# Altium project divisor.PrjPCB
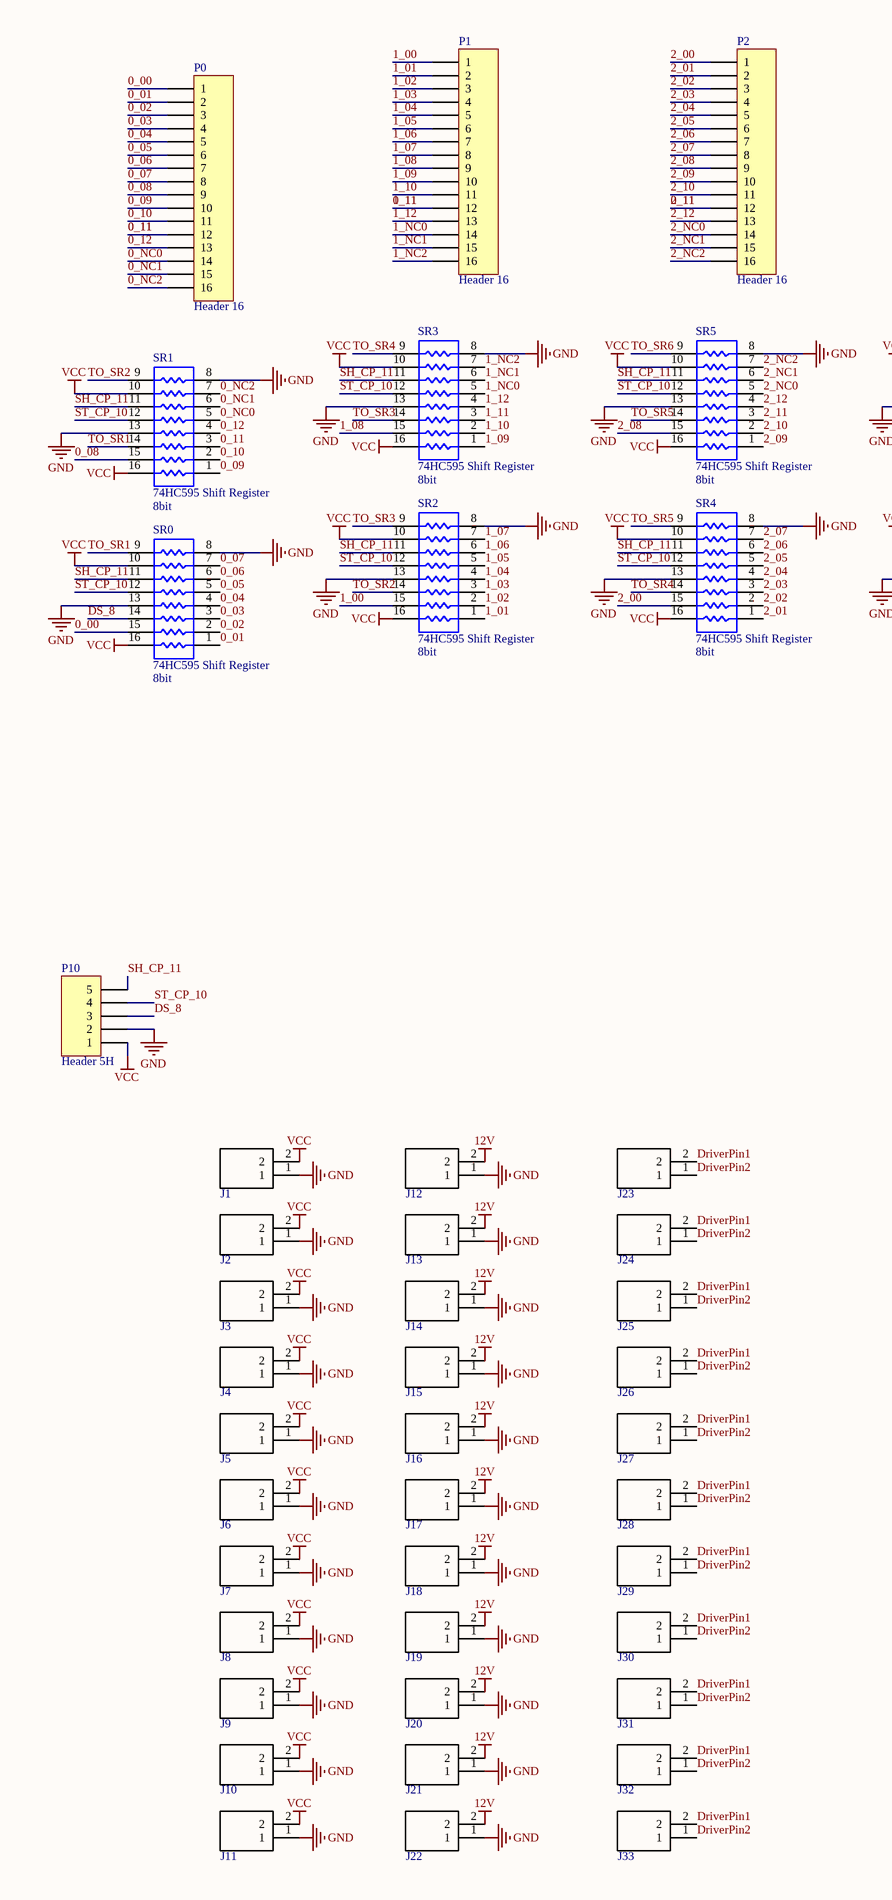
[diagram p0: divisor.SchDoc, left]
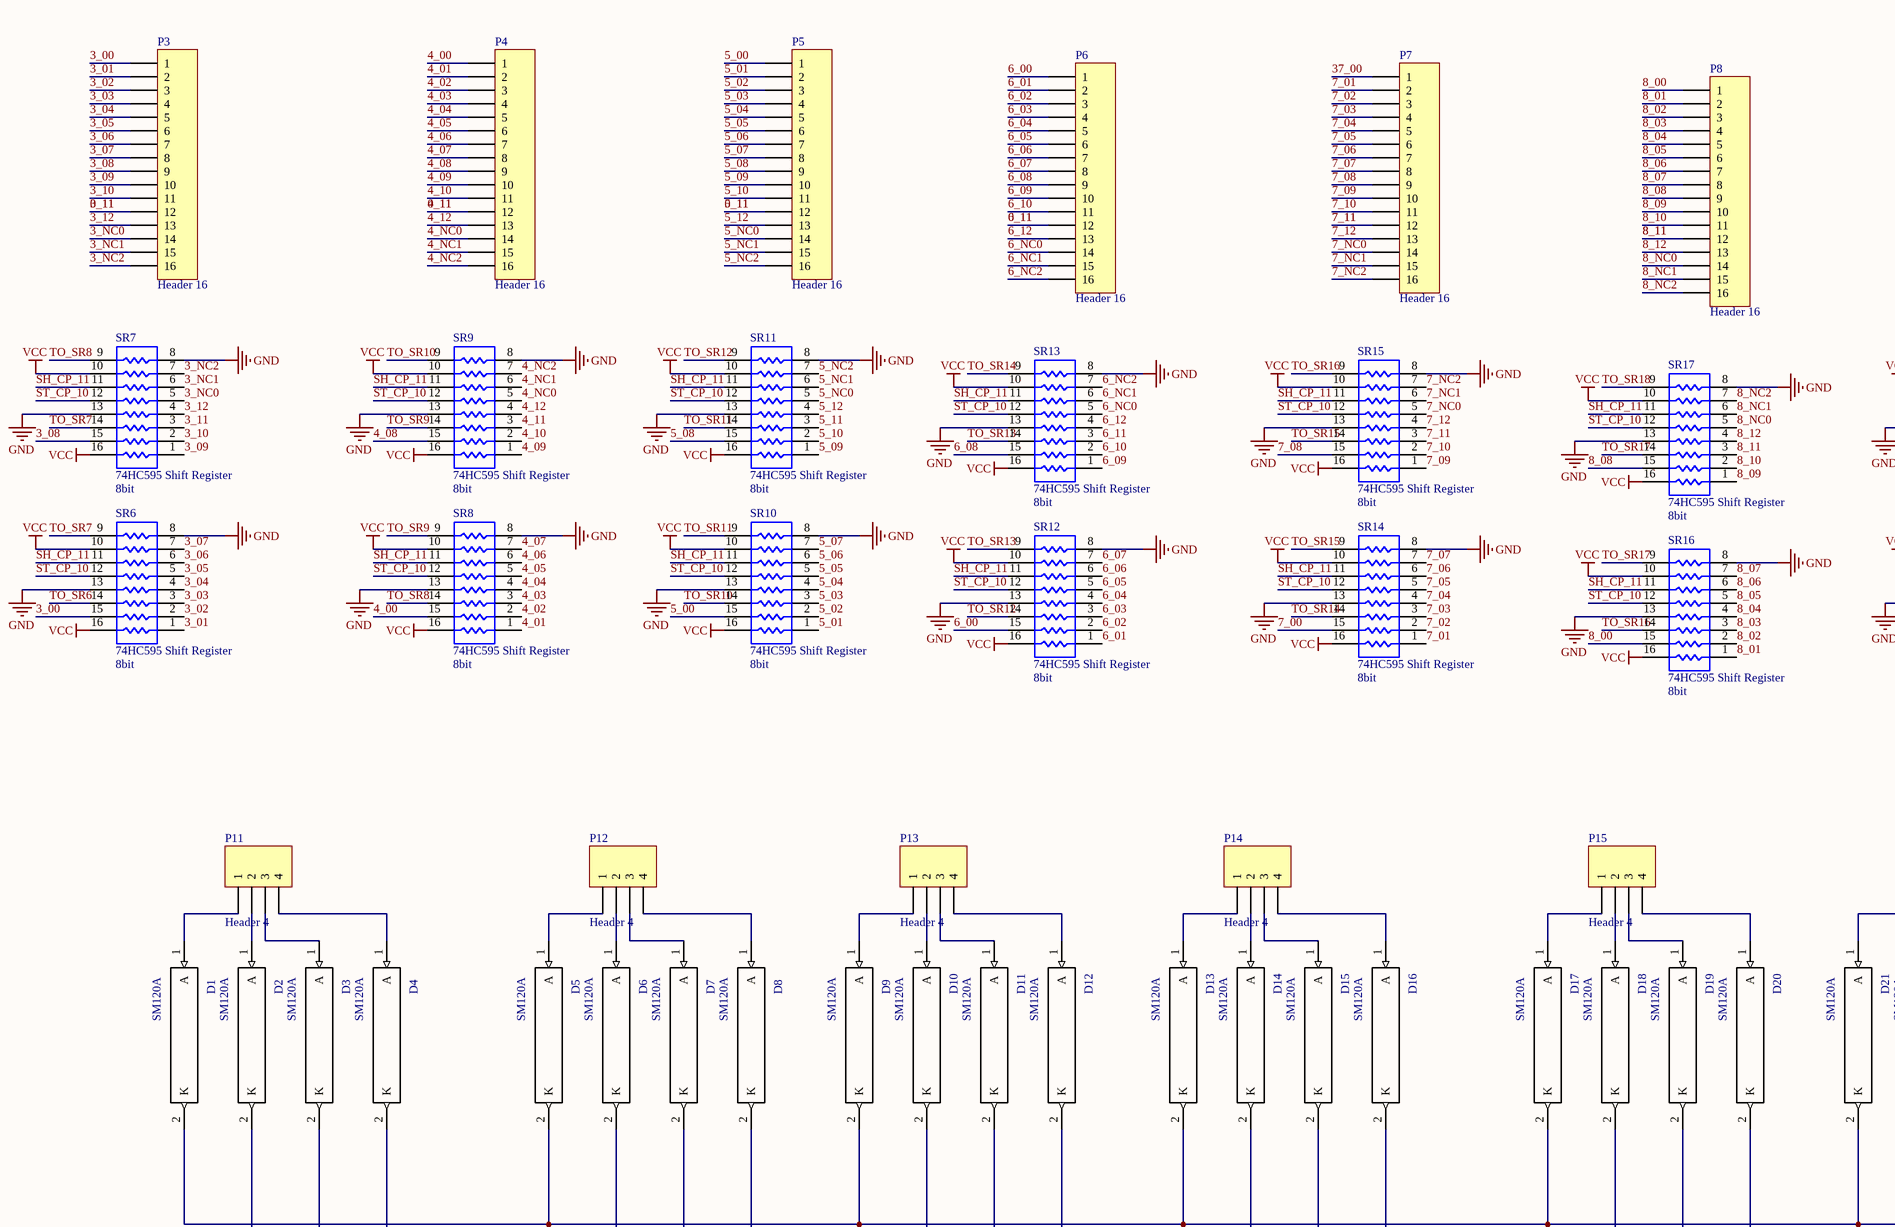
[diagram p1: divisor.SchDoc, middle]
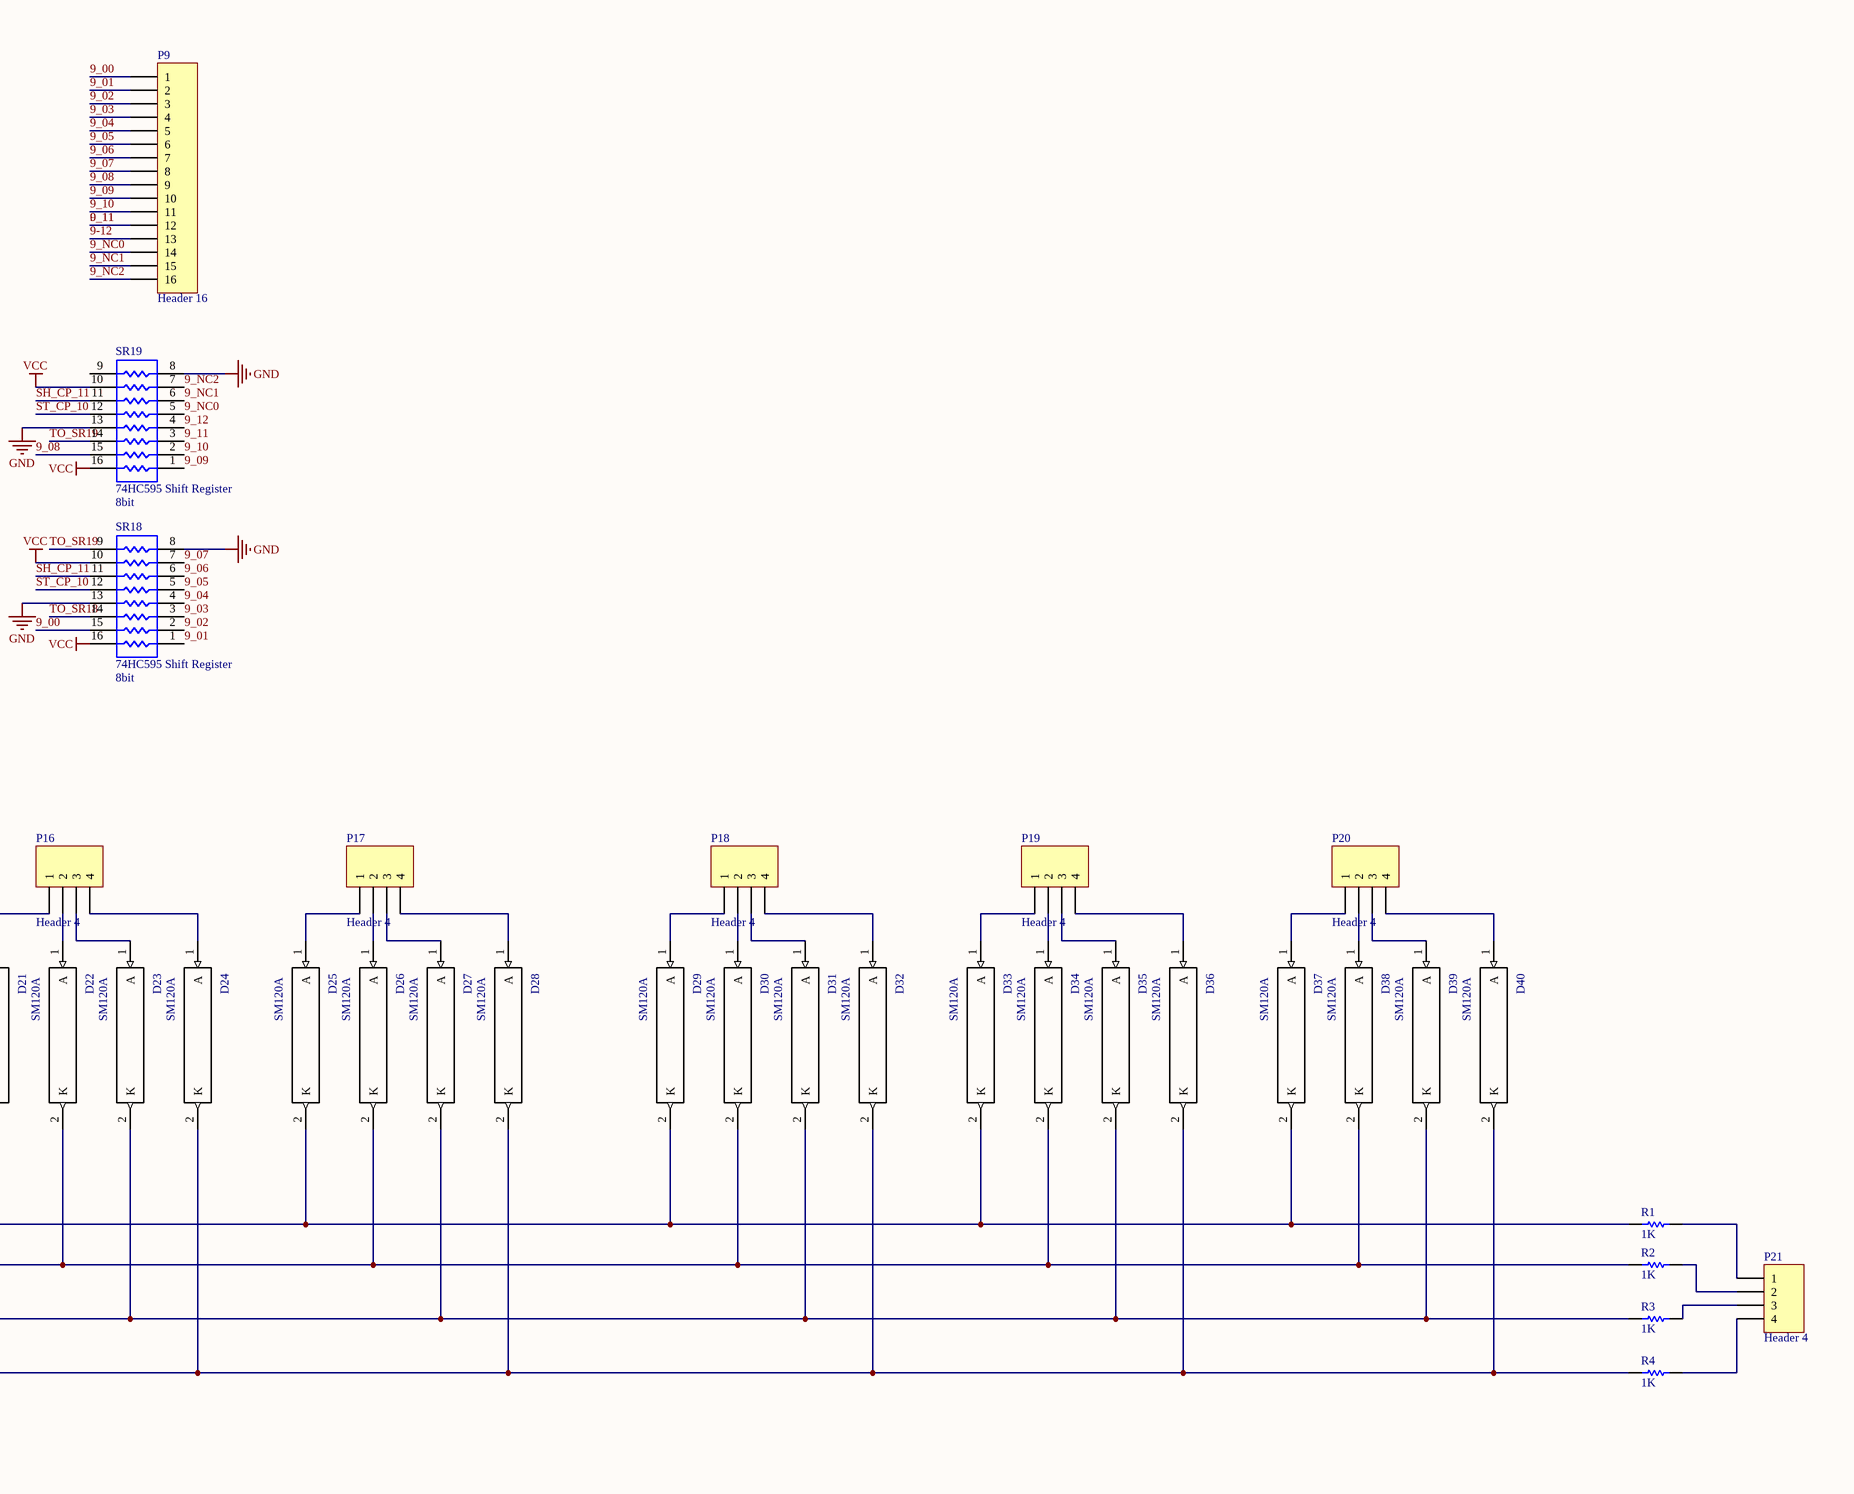
[diagram p2: divisor.SchDoc, right]
1 sheet, 119 parts. Net scope: global (net labels, ports and power ports of the same name join across sheets).
Board files: divisor.PcbDoc, divisor-new.PcbDoc

## Sheet divisor.SchDoc
size A0

### Parts
D1  SM120A  [*DIOM5227X270N_S1M(Primary)]
D2  SM120A  [*DIOM5227X270N_S1M(Primary)]
D3  SM120A  [*DIOM5227X270N_S1M(Primary)]
D4  SM120A  [*DIOM5227X270N_S1M(Primary)]
D5  SM120A  [*DIOM5227X270N_S1M(Primary)]
D6  SM120A  [*DIOM5227X270N_S1M(Primary)]
D7  SM120A  [*DIOM5227X270N_S1M(Primary)]
D8  SM120A  [*DIOM5227X270N_S1M(Primary)]
D9  SM120A  [*DIOM5227X270N_S1M(Primary)]
D10  SM120A  [*DIOM5227X270N_S1M(Primary)]
D11  SM120A  [*DIOM5227X270N_S1M(Primary)]
D12  SM120A  [*DIOM5227X270N_S1M(Primary)]
D13  SM120A  [*DIOM5227X270N_S1M(Primary)]
D14  SM120A  [*DIOM5227X270N_S1M(Primary)]
D15  SM120A  [*DIOM5227X270N_S1M(Primary)]
D16  SM120A  [*DIOM5227X270N_S1M(Primary)]
D17  SM120A  [*DIOM5227X270N_S1M(Primary)]
D18  SM120A  [*DIOM5227X270N_S1M(Primary)]
D19  SM120A  [*DIOM5227X270N_S1M(Primary)]
D20  SM120A  [*DIOM5227X270N_S1M(Primary)]
D21  SM120A  [*DIOM5227X270N_S1M(Primary)]
D22  SM120A  [*DIOM5227X270N_S1M(Primary)]
D23  SM120A  [*DIOM5227X270N_S1M(Primary)]
D24  SM120A  [*DIOM5227X270N_S1M(Primary)]
D25  SM120A  [*DIOM5227X270N_S1M(Primary)]
D26  SM120A  [*DIOM5227X270N_S1M(Primary)]
D27  SM120A  [*DIOM5227X270N_S1M(Primary)]
D28  SM120A  [*DIOM5227X270N_S1M(Primary)]
D29  SM120A  [*DIOM5227X270N_S1M(Primary)]
D30  SM120A  [*DIOM5227X270N_S1M(Primary)]
D31  SM120A  [*DIOM5227X270N_S1M(Primary)]
D32  SM120A  [*DIOM5227X270N_S1M(Primary)]
D33  SM120A  [*DIOM5227X270N_S1M(Primary)]
D34  SM120A  [*DIOM5227X270N_S1M(Primary)]
D35  SM120A  [*DIOM5227X270N_S1M(Primary)]
D36  SM120A  [*DIOM5227X270N_S1M(Primary)]
D37  SM120A  [*DIOM5227X270N_S1M(Primary)]
D38  SM120A  [*DIOM5227X270N_S1M(Primary)]
D39  SM120A  [*DIOM5227X270N_S1M(Primary)]
D40  SM120A  [*DIOM5227X270N_S1M(Primary)]
J1  6-1123723-2  [*TE_6-1123723-2]  (value not drawn)
J2  6-1123723-2  [*TE_6-1123723-2]  (value not drawn)
J3  6-1123723-2  [*TE_6-1123723-2]  (value not drawn)
J4  6-1123723-2  [*TE_6-1123723-2]  (value not drawn)
J5  6-1123723-2  [*TE_6-1123723-2]  (value not drawn)
J6  6-1123723-2  [*TE_6-1123723-2]  (value not drawn)
J7  6-1123723-2  [*TE_6-1123723-2]  (value not drawn)
J8  6-1123723-2  [*TE_6-1123723-2]  (value not drawn)
J9  6-1123723-2  [*TE_6-1123723-2]  (value not drawn)
J10  6-1123723-2  [*TE_6-1123723-2]  (value not drawn)
J11  6-1123723-2  [*TE_6-1123723-2]  (value not drawn)
J12  6-1123723-2  [*TE_6-1123723-2]  (value not drawn)
J13  6-1123723-2  [*TE_6-1123723-2]  (value not drawn)
J14  6-1123723-2  [*TE_6-1123723-2]  (value not drawn)
J15  6-1123723-2  [*TE_6-1123723-2]  (value not drawn)
J16  6-1123723-2  [*TE_6-1123723-2]  (value not drawn)
J17  6-1123723-2  [*TE_6-1123723-2]  (value not drawn)
J18  6-1123723-2  [*TE_6-1123723-2]  (value not drawn)
J19  6-1123723-2  [*TE_6-1123723-2]  (value not drawn)
J20  6-1123723-2  [*TE_6-1123723-2]  (value not drawn)
J21  6-1123723-2  [*TE_6-1123723-2]  (value not drawn)
J22  6-1123723-2  [*TE_6-1123723-2]  (value not drawn)
J23  6-1123723-2  [*TE_6-1123723-2]  (value not drawn)
J24  6-1123723-2  [*TE_6-1123723-2]  (value not drawn)
J25  6-1123723-2  [*TE_6-1123723-2]  (value not drawn)
J26  6-1123723-2  [*TE_6-1123723-2]  (value not drawn)
J27  6-1123723-2  [*TE_6-1123723-2]  (value not drawn)
J28  6-1123723-2  [*TE_6-1123723-2]  (value not drawn)
J29  6-1123723-2  [*TE_6-1123723-2]  (value not drawn)
J30  6-1123723-2  [*TE_6-1123723-2]  (value not drawn)
J31  6-1123723-2  [*TE_6-1123723-2]  (value not drawn)
J32  6-1123723-2  [*TE_6-1123723-2]  (value not drawn)
J33  6-1123723-2  [*TE_6-1123723-2]  (value not drawn)
P0  Header 16  [HDR1X16]
P1  Header 16  [HDR1X16]
P2  Header 16  [HDR1X16]
P3  Header 16  [HDR1X16]
P4  Header 16  [HDR1X16]
P5  Header 16  [HDR1X16]
P6  Header 16  [HDR1X16]
P7  Header 16  [HDR1X16]
P8  Header 16  [HDR1X16]
P9  Header 16  [HDR1X16]
P10  Header 5H  [hdr1x5]
P11  Header 4  [HDR1X4]
P12  Header 4  [HDR1X4]
P13  Header 4  [HDR1X4]
P14  Header 4  [HDR1X4]
P15  Header 4  [HDR1X4]
P16  Header 4  [HDR1X4]
P17  Header 4  [HDR1X4]
P18  Header 4  [HDR1X4]
P19  Header 4  [HDR1X4]
P20  Header 4  [HDR1X4]
P21  Header 4  [HDR1X4]
R1  value 1K  [6-0805_L]  (hidden comment: Res1)
R2  value 1K  [6-0805_L]  (hidden comment: Res1)
R3  value 1K  [6-0805_L]  (hidden comment: Res1)
R4  value 1K  [6-0805_L]  (hidden comment: Res1)
SR0  74HC595 Shift Register  value 8bit  [SO-16_L]
SR1  74HC595 Shift Register  value 8bit  [SO-16_L]
SR2  74HC595 Shift Register  value 8bit  [SO-16_L]
SR3  74HC595 Shift Register  value 8bit  [SO-16_L]
SR4  74HC595 Shift Register  value 8bit  [SO-16_L]
SR5  74HC595 Shift Register  value 8bit  [SO-16_L]
SR6  74HC595 Shift Register  value 8bit  [SO-16_L]
SR7  74HC595 Shift Register  value 8bit  [SO-16_L]
SR8  74HC595 Shift Register  value 8bit  [SO-16_L]
SR9  74HC595 Shift Register  value 8bit  [SO-16_L]
SR10  74HC595 Shift Register  value 8bit  [SO-16_L]
SR11  74HC595 Shift Register  value 8bit  [SO-16_L]
SR12  74HC595 Shift Register  value 8bit  [SO-16_L]
SR13  74HC595 Shift Register  value 8bit  [SO-16_L]
SR14  74HC595 Shift Register  value 8bit  [SO-16_L]
SR15  74HC595 Shift Register  value 8bit  [SO-16_L]
SR16  74HC595 Shift Register  value 8bit  [SO-16_L]
SR17  74HC595 Shift Register  value 8bit  [SO-16_L]
SR18  74HC595 Shift Register  value 8bit  [SO-16_L]
SR19  74HC595 Shift Register  value 8bit  [SO-16_L]

### Nets
12V: J12.2 J13.2 J14.2 J15.2 J16.2 J17.2 J18.2 J19.2 J20.2 J21.2 J22.2
GND: J1.1 J2.1 J3.1 J4.1 J5.1 J6.1 J7.1 J8.1 J9.1 J10.1 J11.1 J12.1 J13.1 J14.1 J15.1 J16.1 J17.1 J18.1 J19.1 J20.1 J21.1 J22.1 P10.2 SR0.8 SR0.13 SR1.8 SR1.13 SR2.8 SR2.13 SR3.8 SR3.13 SR4.8 SR4.13 SR5.8 SR5.13 SR6.8 SR6.13 SR7.8 SR7.13 SR8.8 SR8.13 SR9.8 SR9.13 SR10.8 SR10.13 SR11.8 SR11.13 SR12.8 SR12.13 SR13.8 SR13.13 SR14.8 SR14.13 SR15.8 SR15.13 SR16.8 SR16.13 SR17.8 SR17.13 SR18.8 SR18.13 SR19.8 SR19.13
VCC: J1.2 J2.2 J3.2 J4.2 J5.2 J6.2 J7.2 J8.2 J9.2 J10.2 J11.2 P10.1 SR0.10 SR0.16 SR1.10 SR1.16 SR2.10 SR2.16 SR3.10 SR3.16 SR4.10 SR4.16 SR5.10 SR5.16 SR6.10 SR6.16 SR7.10 SR7.16 SR8.10 SR8.16 SR9.10 SR9.16 SR10.10 SR10.16 SR11.10 SR11.16 SR12.10 SR12.16 SR13.10 SR13.16 SR14.10 SR14.16 SR15.10 SR15.16 SR16.10 SR16.16 SR17.10 SR17.16 SR18.10 SR18.16 SR19.10 SR19.16
0_00: P0.1 SR0.15
0_01: P0.2 SR0.1
0_02: P0.3 SR0.2
0_03: P0.4 SR0.3
0_04: P0.5 SR0.4
0_05: P0.6 SR0.5
0_06: P0.7 SR0.6
0_07: P0.8 SR0.7
0_08: P0.9 SR1.15
0_09: P0.10 SR1.1
0_10: P0.11 SR1.2
0_11: P0.12 P1.12 P2.12 P3.12 P4.12 P5.12 P6.12 P9.12 SR1.3 SR3.3 SR5.3 SR7.3 SR9.3 SR11.3 SR13.3 SR19.3  [also labelled 1_11, 2_11, 3_11, 4_11, 5_11, 6_11, 9_11]
0_12: P0.13 SR1.4
0_NC0: P0.14 SR1.5
0_NC1: P0.15 SR1.6
0_NC2: P0.16 SR1.7
1_00: P1.1 SR2.15
1_01: P1.2 SR2.1
1_02: P1.3 SR2.2
1_03: P1.4 SR2.3
1_04: P1.5 SR2.4
1_05: P1.6 SR2.5
1_06: P1.7 SR2.6
1_07: P1.8 SR2.7
1_08: P1.9 SR3.15
1_09: P1.10 SR3.1
1_10: P1.11 SR3.2
1_12: P1.13 SR3.4
1_NC0: P1.14 SR3.5
1_NC1: P1.15 SR3.6
1_NC2: P1.16 SR3.7
2_00: P2.1 SR4.15
2_01: P2.2 SR4.1
2_02: P2.3 SR4.2
2_03: P2.4 SR4.3
2_04: P2.5 SR4.4
2_05: P2.6 SR4.5
2_06: P2.7 SR4.6
2_07: P2.8 SR4.7
2_08: P2.9 SR5.15
2_09: P2.10 SR5.1
2_10: P2.11 SR5.2
2_12: P2.13 SR5.4
2_NC0: P2.14 SR5.5
2_NC1: P2.15 SR5.6
2_NC2: P2.16 SR5.7
3_00: P3.1 SR6.15
3_01: P3.2 SR6.1
3_02: P3.3 SR6.2
3_03: P3.4 SR6.3
3_04: P3.5 SR6.4
3_05: P3.6 SR6.5
3_06: P3.7 SR6.6
3_07: P3.8 SR6.7
3_08: P3.9 SR7.15
3_09: P3.10 SR7.1
3_10: P3.11 SR7.2
3_12: P3.13 SR7.4
3_NC0: P3.14 SR7.5
3_NC1: P3.15 SR7.6
3_NC2: P3.16 SR7.7
4_00: P4.1 SR8.15
4_01: P4.2 SR8.1
4_02: P4.3 SR8.2
4_03: P4.4 SR8.3
4_04: P4.5 SR8.4
4_05: P4.6 SR8.5
4_06: P4.7 SR8.6
4_07: P4.8 SR8.7
4_08: P4.9 SR9.15
4_09: P4.10 SR9.1
4_10: P4.11 SR9.2
4_12: P4.13 SR9.4
4_NC0: P4.14 SR9.5
4_NC1: P4.15 SR9.6
4_NC2: P4.16 SR9.7
5_00: P5.1 SR10.15
5_01: P5.2 SR10.1
5_02: P5.3 SR10.2
5_03: P5.4 SR10.3
5_04: P5.5 SR10.4
5_05: P5.6 SR10.5
5_06: P5.7 SR10.6
5_07: P5.8 SR10.7
5_08: P5.9 SR11.15
5_09: P5.10 SR11.1
5_10: P5.11 SR11.2
5_12: P5.13 SR11.4
5_NC0: P5.14 SR11.5
5_NC1: P5.15 SR11.6
5_NC2: P5.16 SR11.7
6_00: P6.1 SR12.15
6_01: P6.2 SR12.1
6_02: P6.3 SR12.2
6_03: P6.4 SR12.3
6_04: P6.5 SR12.4
6_05: P6.6 SR12.5
6_06: P6.7 SR12.6
6_07: P6.8 SR12.7
6_08: P6.9 SR13.15
6_09: P6.10 SR13.1
6_10: P6.11 SR13.2
6_12: P6.13 SR13.4
6_NC0: P6.14 SR13.5
6_NC1: P6.15 SR13.6
6_NC2: P6.16 SR13.7
7_00: SR14.15
7_01: P7.2 SR14.1
7_02: P7.3 SR14.2
7_03: P7.4 SR14.3
7_04: P7.5 SR14.4
7_05: P7.6 SR14.5
7_06: P7.7 SR14.6
7_07: P7.8 SR14.7
7_08: P7.9 SR15.15
7_09: P7.10 SR15.1
7_10: P7.11 SR15.2
7_11: P7.12 SR15.3
7_12: P7.13 SR15.4
7_NC0: P7.14 SR15.5
7_NC1: P7.15 SR15.6
7_NC2: P7.16 SR15.7
8_00: P8.1 SR16.15
8_01: P8.2 SR16.1
8_02: P8.3 SR16.2
8_03: P8.4 SR16.3
8_04: P8.5 SR16.4
8_05: P8.6 SR16.5
8_06: P8.7 SR16.6
8_07: P8.8 SR16.7
8_08: P8.9 SR17.15
8_09: P8.10 SR17.1
8_10: P8.11 SR17.2
8_11: P8.12 SR17.3
8_12: P8.13 SR17.4
8_NC0: P8.14 SR17.5
8_NC1: P8.15 SR17.6
8_NC2: P8.16 SR17.7
9-12: P9.13
9_00: P9.1 SR18.15
9_01: P9.2 SR18.1
9_02: P9.3 SR18.2
9_03: P9.4 SR18.3
9_04: P9.5 SR18.4
9_05: P9.6 SR18.5
9_06: P9.7 SR18.6
9_07: P9.8 SR18.7
9_08: P9.9 SR19.15
9_09: P9.10 SR19.1
9_10: P9.11 SR19.2
9_12: SR19.4
9_NC0: P9.14 SR19.5
9_NC1: P9.15 SR19.6
9_NC2: P9.16 SR19.7
37_00: P7.1
DriverPin1: J23.2 J24.2 J25.2 J26.2 J27.2 J28.2 J29.2 J30.2 J31.2 J32.2 J33.2
DriverPin2: J23.1 J24.1 J25.1 J26.1 J27.1 J28.1 J29.1 J30.1 J31.1 J32.1 J33.1
DS_8: P10.3 SR0.14
SH_CP_11: P10.5 SR0.11 SR1.11 SR2.11 SR3.11 SR4.11 SR5.11 SR6.11 SR7.11 SR8.11 SR9.11 SR10.11 SR11.11 SR12.11 SR13.11 SR14.11 SR15.11 SR16.11 SR17.11 SR18.11 SR19.11
ST_CP_10: P10.4 SR0.12 SR1.12 SR2.12 SR3.12 SR4.12 SR5.12 SR6.12 SR7.12 SR8.12 SR9.12 SR10.12 SR11.12 SR12.12 SR13.12 SR14.12 SR15.12 SR16.12 SR17.12 SR18.12 SR19.12
TO_SR1: SR0.9 SR1.14
TO_SR2: SR1.9 SR2.14
TO_SR3: SR2.9 SR3.14
TO_SR4: SR3.9 SR4.14
TO_SR5: SR4.9 SR5.14
TO_SR6: SR5.9 SR6.14
TO_SR7: SR6.9 SR7.14
TO_SR8: SR7.9 SR8.14
TO_SR9: SR8.9 SR9.14
TO_SR10: SR9.9 SR10.14
TO_SR11: SR10.9 SR11.14
TO_SR12: SR11.9 SR12.14
TO_SR13: SR12.9 SR13.14
TO_SR14: SR13.9 SR14.14
TO_SR15: SR14.9 SR15.14
TO_SR16: SR15.9 SR16.14
TO_SR17: SR16.9 SR17.14
TO_SR18: SR17.9 SR18.14
TO_SR19: SR18.9 SR19.14
NetD1_1: D1.1(A) P11.1
NetD1_2: D1.2(K) D5.2(K) D9.2(K) D13.2(K) D17.2(K) D21.2(K) D25.2(K) D29.2(K) D33.2(K) D37.2(K) R1.1
NetD2_1: D2.1(A) P11.2
NetD2_2: D2.2(K) D6.2(K) D10.2(K) D18.2(K) D22.2(K) D26.2(K) D30.2(K) D34.2(K) D38.2(K) R2.1
NetD3_1: D3.1(A) P11.3
NetD3_2: D3.2(K) D7.2(K) D11.2(K) D14.2(K) D19.2(K) D23.2(K) D27.2(K) D31.2(K) D35.2(K) D39.2(K) R3.1
NetD4_1: D4.1(A) P11.4
NetD4_2: D4.2(K) D8.2(K) D12.2(K) D15.2(K) D16.2(K) D20.2(K) D24.2(K) D28.2(K) D32.2(K) D36.2(K) D40.2(K) R4.1
NetD5_1: D5.1(A) P12.1
NetD6_1: D6.1(A) P12.2
NetD7_1: D7.1(A) P12.3
NetD8_1: D8.1(A) P12.4
NetD9_1: D9.1(A) P13.1
NetD10_1: D10.1(A) P13.2
NetD11_1: D11.1(A) P13.3
NetD12_1: D12.1(A) P13.4
NetD13_1: D13.1(A) P14.1
NetD14_1: D14.1(A) P14.2
NetD15_1: D15.1(A) P14.3
NetD16_1: D16.1(A) P14.4
NetD17_1: D17.1(A) P15.1
NetD18_1: D18.1(A) P15.2
NetD19_1: D19.1(A) P15.3
NetD20_1: D20.1(A) P15.4
NetD21_1: D21.1(A) P16.1
NetD22_1: D22.1(A) P16.2
NetD23_1: D23.1(A) P16.3
NetD24_1: D24.1(A) P16.4
NetD25_1: D25.1(A) P17.1
NetD26_1: D26.1(A) P17.2
NetD27_1: D27.1(A) P17.3
NetD28_1: D28.1(A) P17.4
NetD29_1: D29.1(A) P18.1
NetD30_1: D30.1(A) P18.2
NetD31_1: D31.1(A) P18.3
NetD32_1: D32.1(A) P18.4
NetD33_1: D33.1(A) P19.1
NetD34_1: D34.1(A) P19.2
NetD35_1: D35.1(A) P19.3
NetD36_1: D36.1(A) P19.4
NetD37_1: D37.1(A) P20.1
NetD38_1: D38.1(A) P20.2
NetD39_1: D39.1(A) P20.3
NetD40_1: D40.1(A) P20.4
NetP21_1: P21.1 R1.2
NetP21_2: P21.2 R2.2
NetP21_3: P21.3 R3.2
NetP21_4: P21.4 R4.2

Not connected (* = marked no-connect by the designer): SR19 9

### Notes on the sheet
- Title
- Size:
- Date:
- File:
- A0
- Number:
- Time:
- Revision:
- Sheet
- of

### Library data of the parts
D1-D40 = STPS2L60A: SCHOTTKY RECTIFIER 2A; Voltage Vrrm: 60V; Diode Case Style: DO-214AC; Case Style: DO-214AC; pin to pad: 1>A 2>A; MF: STMicroelectronics; Price: None; Availability: Unavailable; SnapEDA_Link: https://www.snapeda.com/parts/STPS2L60A/STMicroelectronics/view-part/?ref=snap; Package: DO-214 STMicroelectronics; MP: STPS2L60A; Value: *
J1-J33 = 6-1123723-2: 3.96 EP HDR ASSY 2P_GREEN_; MF: TE Connectivity; Number_of_Positions: 2; Product_Type: Header; Centerline_Pitch: 3.96 mm[.156 in]; TE_purchase_URL: https://www.te.com/usa-en/product-6-1123723-2.html?te_bu=Cor&te_type=disp&te_campaign=seda_glo_cor-seda-global-disp-prtnr-fy19-seda-model-bom-cta_sma-317_1&elqCampaignId=32493; MP: 6-1123723-2; Price: None; Availability: Unavailable; Package: None; EU_RoHS_Compliance: Compliant; SnapEDA_Link: https://www.snapeda.com/parts/6-1123723-2/TE%20Connectivity%20AMP%20Connectors/view-part/?ref=snap; Value: *
P0-P9 = Header 16: Header, 16-Pin; LatestRevisionDate: 17-Jul-2002; LatestRevisionNote: Re-released for DXP Platform.; Publisher: Altium Limited
P10 = Header 5H: Header, 5-Pin, Right Angle; LatestRevisionDate: 17-Jul-2002; LatestRevisionNote: Re-released for DXP Platform.; Publisher: Altium Limited
P11-P21 = Header 4: Header, 4-Pin; LatestRevisionDate: 17-Jul-2002; LatestRevisionNote: Re-released for DXP Platform.; Publisher: Altium Limited
R1-R4 = Res1: Resistor; Published: 8-Jun-2000; LatestRevisionDate: 17-Jul-2002; LatestRevisionNote: Re-released for DXP Platform.; PackageReference: AXIAL-0.3; Publisher: Altium Limited; PackageDescription: Axial Device, Thru-Hole; 2 Leads; 0.3 in Pin Spacing
SR0-SR19 = Res Pack3: Isolated Resistor Network; Published: 24-Mar-1999; LatestRevisionDate: 29-May-2009; LatestRevisionNote: IPC-7351 Footprint Added.; PackageReference: SO-16; Publisher: Altium Limited; PackageDescription: 16-Pin Small Outline Integrated Circuit 1.27 mm Pitch; Code_JEDEC: MS-012-AC; Code_IPC: SOIC127P600-16